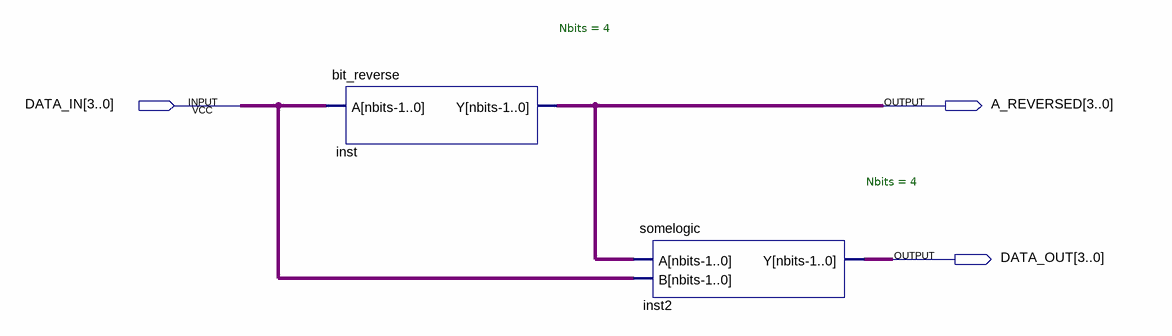
[diagram p0: schematic sheet]
// Quartus schematic demo.bdf as structural Verilog: 2 symbols, 3 pins
module demo (
  input  [3:0] DATA_IN,
  output [3:0] A_REVERSED,
  output [3:0] DATA_OUT
);

  bit_reverse #(.Nbits(4)) inst (.A(DATA_IN), .Y(A_REVERSED));
  somelogic #(.Nbits(4)) inst2 (.A(A_REVERSED), .B(DATA_IN), .Y(DATA_OUT));
endmodule
